# Altium project Gimbal.PrjPcb
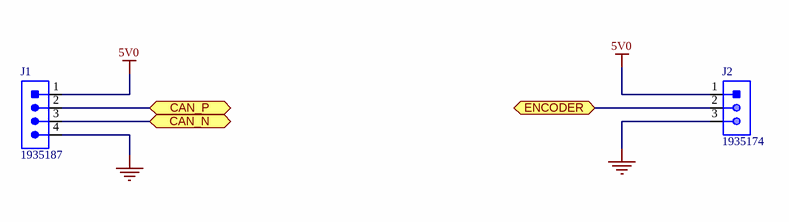
[diagram p0: SH1 - CONNECTORS.SchDoc]
4 sheets, 8 parts. Net scope: flat (ports and power ports of the same name join across sheets).
Sheets:
  SH1 - CONNECTORS.SchDoc
  SH2 - POWER.SchDoc
  SH3 - CAN.SchDoc
  SH4 - MICROCONTROLLER.SchDoc

## Sheet SH1 - CONNECTORS.SchDoc: CONNECTORS
size 279 x 215 mm; CheckedBy: Lance Bantoto; Engineer: Taylor McNabb; Revision: 1; SheetNumber: 1; SheetTotal: 4

### Parts
J1  CON_4POS_SCREW_TERM  [1935187]  (value not drawn)
J2  CON_3POS_SCREW_TERM  [1935174]  (value not drawn)

### Ports
CAN_N (bidir), CAN_P (bidir), ENCODER (bidir)

### Nets
5V0: J1.1 J2.1
GND: J1.4 J2.3
CAN_N: J1.3 ; port CAN_N
CAN_P: J1.2 ; port CAN_P
NetJ2_2: J2.2 ; port ENCODER

### Notes on the sheet
- University of Waterloo Robotics Team
- 200 University Ave W
- REV
- PROJECT
- Waterloo, Ontario, Canada
- N2L 3G1
- DOCUMENT
- ENGINEER
- REVIEWER
- MODIFIED
- SHEET
- OF

### Library data of the parts
J1 = CON_4POS_SCREW_TERM: TERM BLK 4POS SIDE ENTRY 5MM; Manufacturer 1: Phoenix Contact; Wire Gauge: 12-26AWG; Package/Footprint: TH; Screw Thread: M2.6; Supplier Part Number 1: 277-1579-ND; Supplier 1: Digi-Key; Pitch: 5mm; Mounting Type: TH; Manufacturer Part Number 1: 1935187
J2 = CON_3POS_SCREW_TERM: TERM BLK 3POS SIDE ENTRY 5MM; Manufacturer 1: Phoenix Contact; Package/Footprint: TH; Voltage Rating: 250V; Current Rating: 17.5A; Supplier 1: Digi-Key; Mounting Type: TH; Orientation: Straight; Pitch: 5mm; Supplier Part Number 1: 277-1578-ND; Manufacturer Part Number 1: 1935174

## Sheet SH2 - POWER.SchDoc: POWER
size 279 x 215 mm; CheckedBy: Lance Bantoto; Engineer: Taylor McNabb; Revision: 1; SheetNumber: 1; SheetTotal: 5
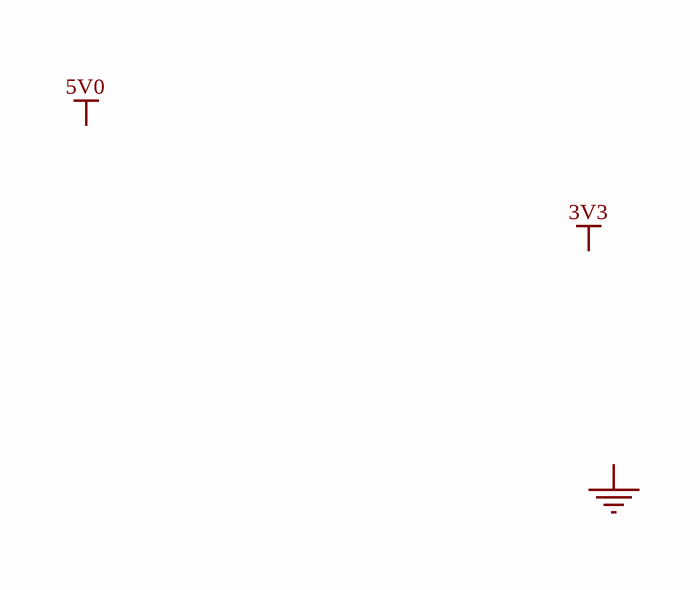
[diagram p1: SH2 - POWER.SchDoc]

### Notes on the sheet
- Labels drawn without touching a wire or pin: 3V3, 5V0, GND
- University of Waterloo Robotics Team
- 200 University Ave W
- REV
- PROJECT
- Waterloo, Ontario, Canada
- N2L 3G1
- DOCUMENT
- ENGINEER
- REVIEWER
- MODIFIED
- SHEET
- OF

## Sheet SH3 - CAN.SchDoc: CAN
size 279 x 215 mm; CheckedBy: Lance Bantoto; Engineer: Taylor McNabb; Revision: 1; SheetNumber: 3; SheetTotal: 4
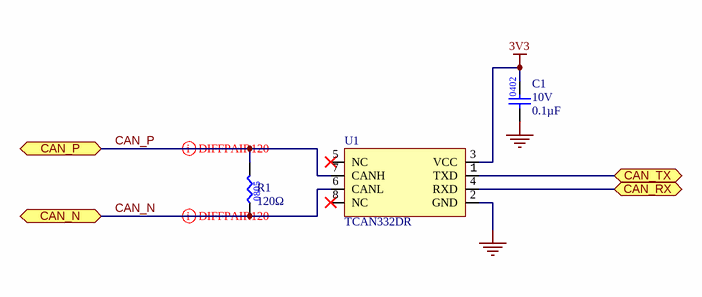
[diagram p2: SH3 - CAN.SchDoc]

### Parts
C1  value 0.1µF  Voltage Rating: 10V  [CAP0402]  (hidden comment: CAP_0.1uF_10V_0402)
R1  value 120Ω  [RES0805]  (hidden comment: RES_120Ω_0805_1%)
U1  IC_CAN_TRANSCEIVER_1MBPS  [TCAN332DR]  (value not drawn)

### Ports
CAN_N (bidir), CAN_P (bidir), CAN_RX (bidir), CAN_TX (bidir)

### Nets
3V3: C1.2 U1.3(VCC)
GND: C1.1 U1.2(GND)
CAN_N: R1.1 U1.6(CANL) ; port CAN_N
CAN_P: R1.2 U1.7(CANH) ; port CAN_P
NetU1_1: U1.1(TXD) ; port CAN_TX
NetU1_4: U1.4(RXD) ; port CAN_RX

Not connected (* = marked no-connect by the designer): U1 5(NC)* 8(NC)*

### Layout directives
differential pair: CAN_N, CAN_P

### Notes on the sheet
- University of Waterloo Robotics Team
- 200 University Ave W
- REV
- PROJECT
- Waterloo, Ontario, Canada
- N2L 3G1
- DOCUMENT
- ENGINEER
- REVIEWER
- MODIFIED
- SHEET
- OF

### Library data of the parts
C1 = CAP_0.1uF_10V_0402: CAP CER 0.1UF 10V X7R 0402; Manufacturer 1: Murata Electronics; Manufacturer Part Number 1: GRM155R71A104KA01D; Package/Footprint: 0402; Supplier 1: Digi-Key; Supplier Part Number 1: 490-6321-1-ND
R1 = RES_120Ω_0805_1%: RES 120 OHM 1% 1/8W 0805; Manufacturer 1: Vishay; Manufacturer Part Number 1: CRCW0805120RFKEA; Package/Footprint: 0805; Supplier Part Number 1: 541-120CCT-ND; Supplier 1: Digi-Key; LCSC Part #: C17437; Mounting Type: SMD
U1 = IC_CAN_TRANSCEIVER_1MBPS: IC TXRX CAN 1MBPS 8SOIC; Manufacturer 1: Texas Instruments; Voltage - Supply: 3V ~ 3.6V; Package/Footprint: 8-SOIC; Receiver Hysteresis: 120 mV; ComponentLink1Description: New link; ComponentLink1URL: *; Supplier 1: Digi-Key; Supplier Part Number 1: 296-43711-1-ND; Data Rate: 1Mbps; Operating Temperature: -40°C ~ 125°C; Mounting Type: Surface Mount; Manufacturer Part Number 1: TCAN332DR

## Sheet SH4 - MICROCONTROLLER.SchDoc: MICROCONTROLLER
size 279 x 215 mm; CheckedBy: Lance Bantoto; Engineer: Taylor McNabb; Revision: 1; SheetNumber: 4; SheetTotal: 4
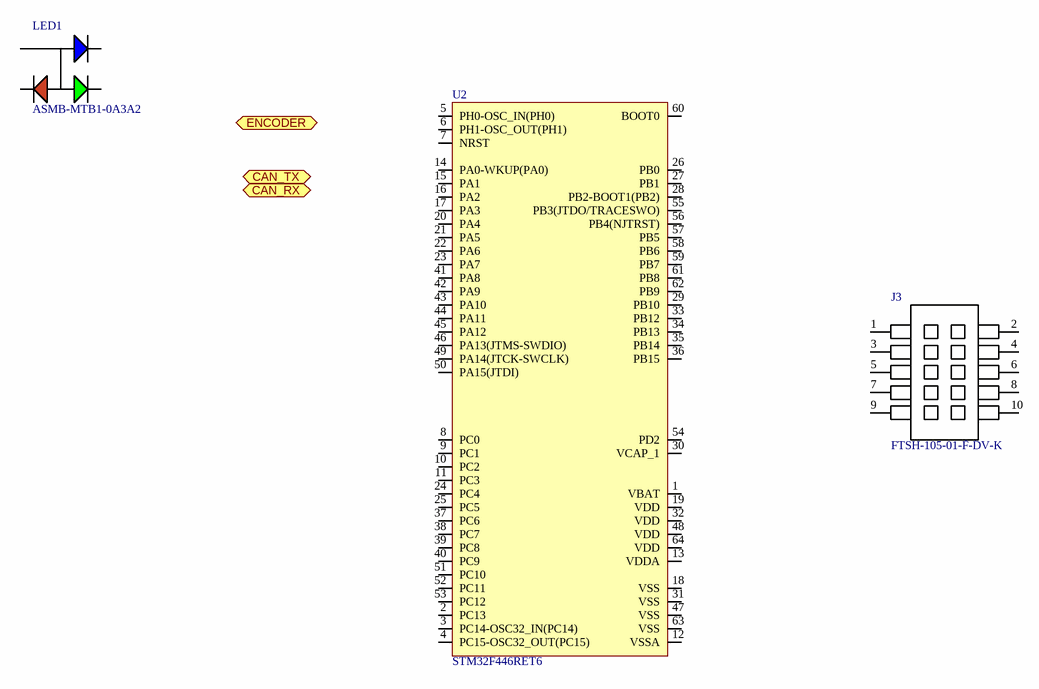
[diagram p3: SH4 - MICROCONTROLLER.SchDoc]

### Parts
J3  Manufacturer Part Number 1: FTSH-105-01-F-DV-K  [FTSH-105-01-F-DV-K-P-TR]  (hidden comment: CON_PROGRAMMING)
LED1  Manufacturer Part Number 1: ASMB-MTB1-0A3A2  [LED_RGB]  (hidden comment: LED_RGB)
U2  STM32F446RET6  [STM_LQFP64_N]

### Ports
CAN_RX (bidir), CAN_TX (bidir), ENCODER (bidir)

### Nets

Not connected (* = marked no-connect by the designer): J3 1 2 3 4 5 6 7 8 9 10; LED1 1(CATHODE_(RED)) 2(CATHODE_(GREEN)) 3(CATHODE_(BLUE)) 4(COMMON_ANODE); U2 1(VBAT) 2(PC13) 3(PC14-OSC32_IN(PC14)) 4(PC15-OSC32_OUT(PC15)) 5(PH0-OSC_IN(PH0)) 6(PH1-OSC_OUT(PH1)) 7(NRST) 8(PC0) 9(PC1) 10(PC2) 11(PC3) 12(VSSA) 13(VDDA) 14(PA0-WKUP(PA0)) 15(PA1) 16(PA2) 17(PA3) 18(VSS) 19(VDD) 20(PA4) 21(PA5) 22(PA6) 23(PA7) 24(PC4) 25(PC5) 26(PB0) 27(PB1) 28(PB2-BOOT1(PB2)) 29(PB10) 30(VCAP_1) 31(VSS) 32(VDD) 33(PB12) 34(PB13) 35(PB14) 36(PB15) 37(PC6) 38(PC7) 39(PC8) 40(PC9) 41(PA8) 42(PA9) 43(PA10) 44(PA11) 45(PA12) 46(PA13(JTMS-SWDIO)) 47(VSS) 48(VDD) 49(PA14(JTCK-SWCLK)) 50(PA15(JTDI)) 51(PC10) 52(PC11) 53(PC12) 54(PD2) 55(PB3(JTDO/TRACESWO)) 56(PB4(NJTRST)) 57(PB5) 58(PB6) 59(PB7) 60(BOOT0) 61(PB8) 62(PB9) 63(VSS) 64(VDD)

### Notes on the sheet
- University of Waterloo Robotics Team
- 200 University Ave W
- REV
- PROJECT
- Waterloo, Ontario, Canada
- N2L 3G1
- DOCUMENT
- ENGINEER
- REVIEWER
- MODIFIED
- SHEET
- OF

### Library data of the parts
J3 = CON_PROGRAMMING: CONN HEADER SMD 10POS 1.27MM; Manufacturer 1: Samtec; Supplier 1: Digi-Key; Mounting Type: SMD; Pitch: 1.27mm; Supplier Part Number 1: SAM8796-ND
LED1 = LED_RGB: LED RGB DIFFUSED 4PLCC SMD; Manufacturer 1: Broadcom; Color: Blue,Green,Red; Lens Color: White; Viewing Angle: 115°; Lens Style: Round; Luminous Intensity: 350mcd; Dominant Wavelength: 470nm; Forward Voltage: 3.1V; Test Current: 20mA; Package/Footprint: 4-PLCC; Supplier 1: Digi-Key; Mounting Type: SMD; Number of Pins: 4; Lens Transparency: Diffused; Supplier Part Number 1: 516-3280-1-ND
U2 = STM32F446RET6: IC MCU 32BIT 512KB FLASH 64LQFP; Manufacturer 1: STMicroelectronics; Manufacturer Part Number 1: LF80CDT-TR; Supplier 1: Digi-Key; Supplier Part Number 1: 497-15376-ND

## Nets that join several sheets
GND: SH1 - CONNECTORS (J1.4 J2.3), SH3 - CAN (C1.1 U1.2)
CAN_N: SH1 - CONNECTORS (J1.3), SH3 - CAN (R1.1 U1.6)
CAN_P: SH1 - CONNECTORS (J1.2), SH3 - CAN (R1.2 U1.7)